# EAGLE schematic diagram (EAGLE 7.3.0)
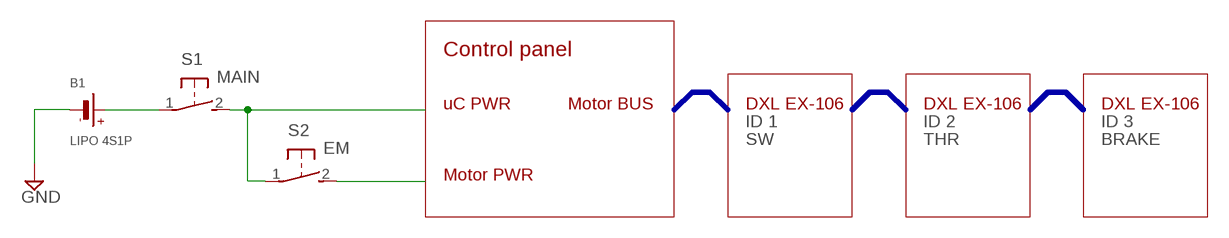
[diagram p0: schematic, sheet 1]

## Parts
B1  LIPO 4S1P  BATTERY  [JSTPH2]
S1  MAIN  31-XX  [B3F-31XX]
S2  EM  31-XX  [B3F-31XX]

## Nets
GND: B1.1(-)
N$1: S1.2(S) S2.1(P)
N$2: B1.2(+) S1.1(P)
N$3: S2.2(S)

## Buses
B$1
B$2
B$3

## Notes on the sheet
- Control panel
- uC PWR | Motor BUS | DXL EX-106 | DXL EX-106 | DXL EX-106
- ID 1 | ID 2 | ID 3
- SW | THR | BRAKE
- Motor PWR

## Library data of the parts
B1 = microbuilder:BATTERY: CR1220 SMT - Digikey: 3001K-ND
S1 S2 = adafruit:31-XX: OMRON SWITCH Now with beefier pads!